# Altium schematic sheet Sheet1.SchDoc
size A4
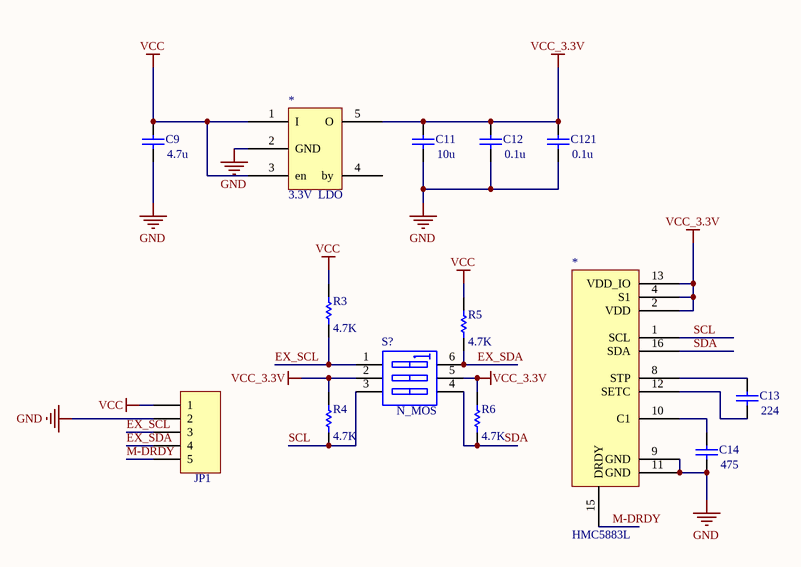
[diagram p0: Sheet1.SchDoc]

## Parts
(Parts that share a designator on the sheet are numbered #1, #2 ... from top to bottom, then left to right.)
*#1  3.3V  LDO  [SOT23-5_M]
*#2  HMC5883L  [HMC5883L]
?  JP1  [HDR1X5]
C9  value 4.7u  [1608[0603]]  (hidden comment: Cap)
C11  value 10u  [3.2X1.6X1.1]  (hidden comment: Cap)
C12  value 0.1u  [1608[0603]]  (hidden comment: Cap)
C13  value 224  [6-0805_N]  (hidden comment: Cap)
C14  value 475  [6-0805_N]  (hidden comment: Cap)
C121  value 0.1u  [1608[0603]]  (hidden comment: Cap)
R3  value 4.7K  [1608[0603]]  (hidden comment: Res1)
R4  value 4.7K  [1608[0603]]  (hidden comment: Res1)
R5  value 4.7K  [1608[0603]]  (hidden comment: Res1)
R6  value 4.7K  [1608[0603]]  (hidden comment: Res1)
S?  N_MOS  [SOT23-6_M]

## Nets
GND: *#1.2(GND) *#2.9(GND) *#2.11(GND) ?.2 C9.1 C11.1 C12.1 C14.1 C121.1
VCC: *#1.1(I) *#1.3(en) ?.1 C9.2 R3.2 R5.2
VCC_3.3V: *#1.5(O) *#2.2(VDD) *#2.4(S1) *#2.13(VDD_IO) C11.2 C12.2 C121.2 R4.2 R6.2 S?.2(A2) S?.5(B2)
EX_SCL: ?.3 R3.1 S?.1(A1)
EX_SDA: ?.4 R5.1 S?.6(B1)
M-DRDY: *#2.15(DRDY) ?.5
SCL: *#2.1(SCL) R4.1 S?.3(A3)
SDA: *#2.16(SDA) R6.1 S?.4(B3)
Net*#2_8: *#2.8(STP) C13.2
Net*#2_10: *#2.10(C1) C14.2
Net*#2_12: *#2.12(SETC) C13.1

Not connected (* = marked no-connect by the designer): *#1 4(by)

## Library data of the parts
? = Header 5: Header, 5-Pin; LatestRevisionDate: 17-Jul-2002; LatestRevisionNote: Re-released for DXP Platform.; Publisher: Altium Limited
C9 C11-C14 C121 = Cap: Capacitor; Published: 8-Jun-2000; LatestRevisionDate: 17-Jul-2002; LatestRevisionNote: Re-released for DXP Platform.; PackageReference: RAD-0.3; Publisher: Altium Limited; PackageDescription: Radial Cap, Thru-Hole; 2 Leads; 0.3 in Pin Spacing
R3-R6 = Res1: Resistor; Published: 8-Jun-2000; LatestRevisionDate: 17-Jul-2002; LatestRevisionNote: Re-released for DXP Platform.; PackageReference: AXIAL-0.3; Publisher: Altium Limited; PackageDescription: Axial Device, Thru-Hole; 2 Leads; 0.3 in Pin Spacing
S? = SW DIP-3: DIP Switch, 3 Position, SPST; Published: 24-Mar-1999; LatestRevisionDate: 17-Jul-2002; LatestRevisionNote: Re-released for DXP Platform.; PackageReference: DIP-6; Publisher: Altium Limited; Code_JEDEC: MO-001-AM